# EAGLE design eeZee_big_tiny (EAGLE 6.4)
DATABASE: ./../../../EAGLE/PARTSDB.TXT
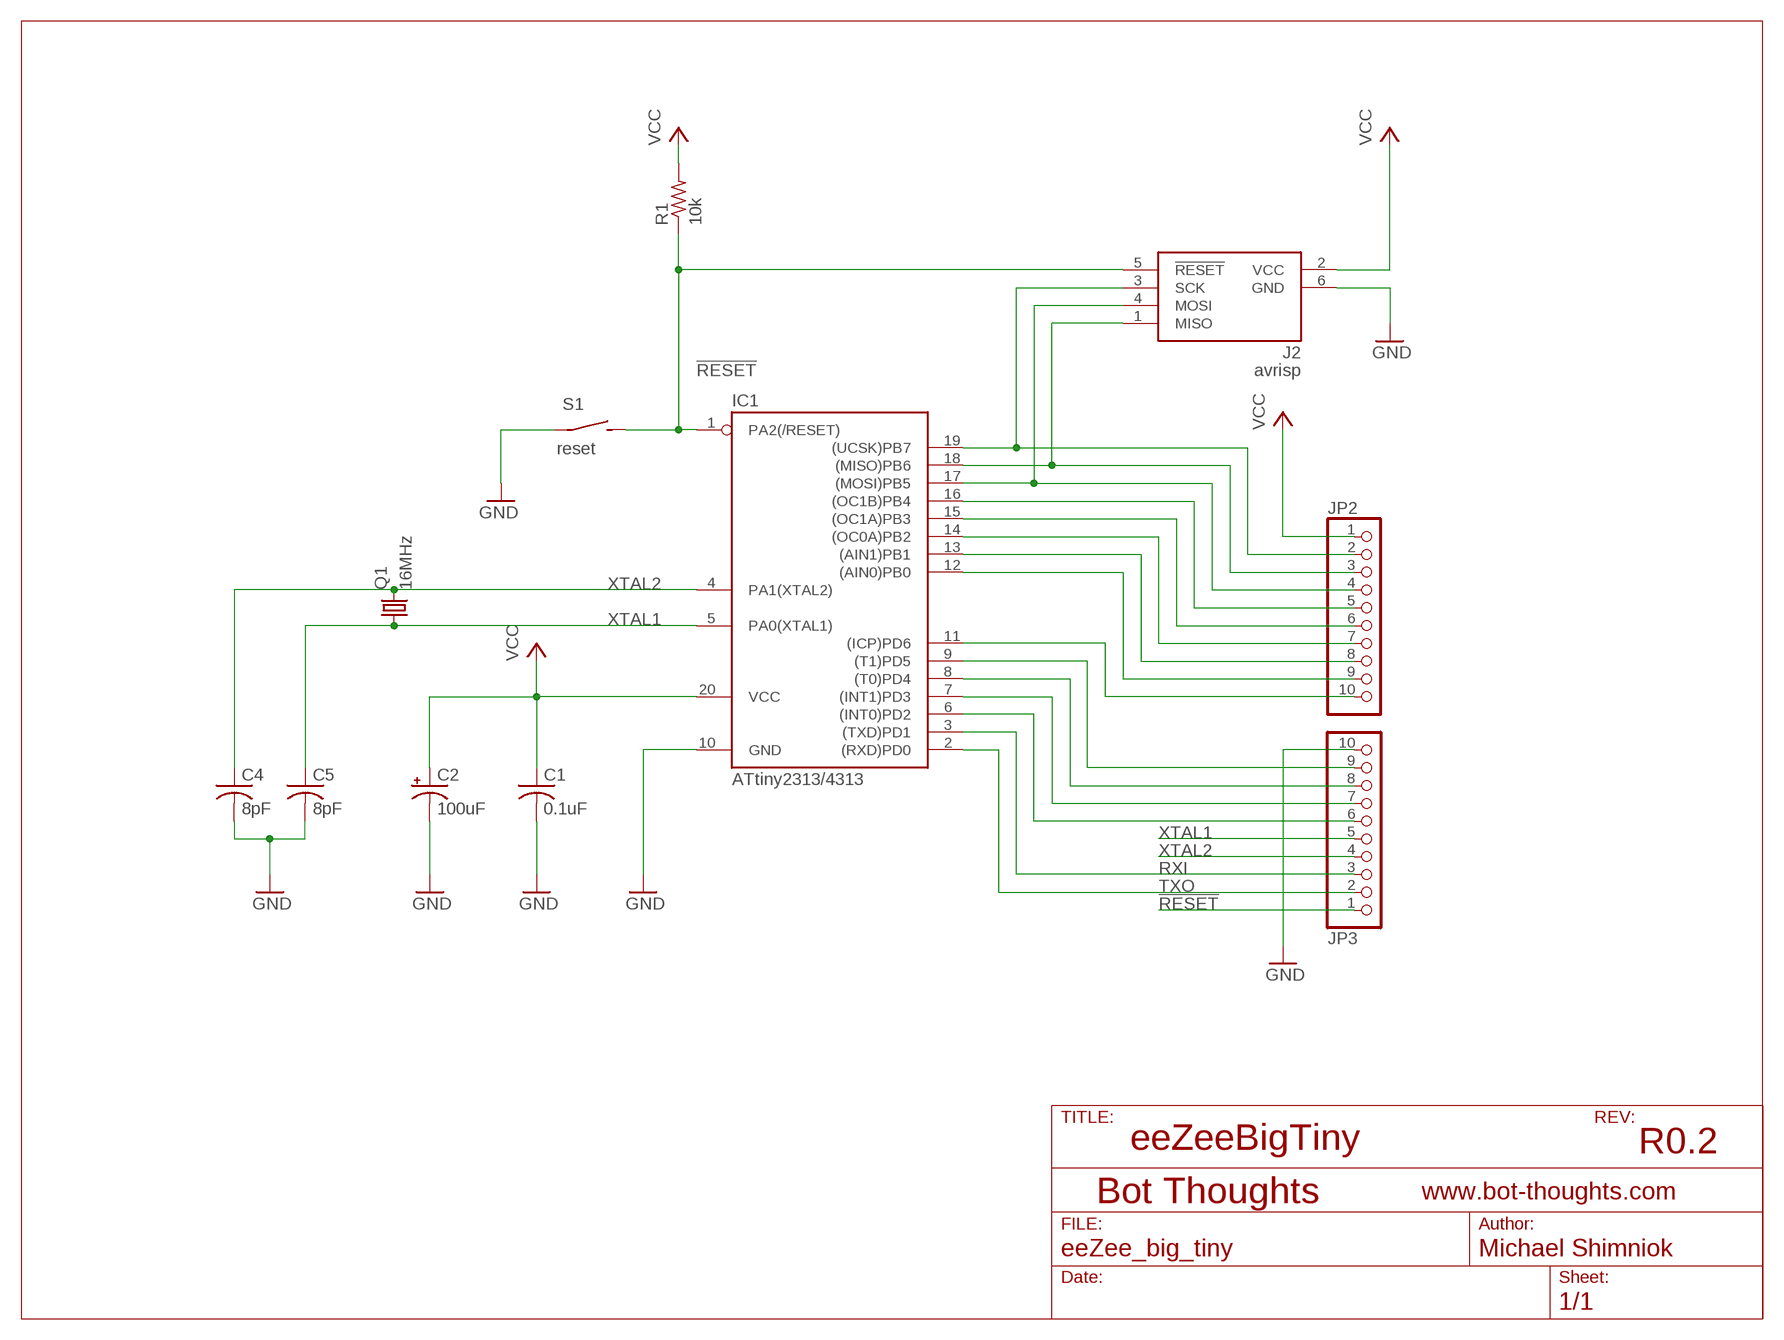
[diagram p0: schematic, sheet 1]

## Parts
C1  0.1uF  C-USC0603  [C0603]
C2  100uF  CAP_POL_SMC_B  [SMC_B]
C4  8pF  C-USC0603  [C0603]
C5  8pF  C-USC0603  [C0603]
IC1  ATtiny2313/4313  TINY2313-*P*  [DIL20]
J2  avrisp  AVRISP6  [CON6P2R]
JP2  PINHD-1X10_2.54-S  [1X10-S]
JP3  PINHD-1X10_2.54-S  [1X10-S]
Q1  16MHz  CRYSTALNDK5X3  [NDK_2PAD_5X3]
R1  10k  R-US_R0603  [R0603]
S1  reset  SPST_TAC_RECT1  [6MMTACTILE_RECT]

## Nets
!RESET: IC1.1(PA2(/RESET)) J2.5(!RESET) JP3.1 R1.1 S1.P$2(S)
GND: C1.2 C2.- C4.2 C5.2 IC1.10(GND) J2.6(GND) JP3.10 S1.P$1(P)
N$2: IC1.18((MISO)PB6) J2.1(MISO) JP2.3
N$3: IC1.17((MOSI)PB5) J2.4(MOSI) JP2.4
N$4: IC1.19((UCSK)PB7) J2.3(SCK) JP2.2
N$6: IC1.6((INT0)PD2) JP3.6
N$7: IC1.7((INT1)PD3) JP3.7
N$8: IC1.8((T0)PD4) JP3.8
N$9: IC1.9((T1)PD5) JP3.9
N$10: IC1.11((ICP)PD6) JP2.10
N$11: IC1.12((AIN0)PB0) JP2.9
N$12: IC1.13((AIN1)PB1) JP2.8
N$13: IC1.14((OC0A)PB2) JP2.7
N$14: IC1.15((OC1A)PB3) JP2.6
N$15: IC1.16((OC1B)PB4) JP2.5
RXI: IC1.3((TXD)PD1) JP3.3
TXO: IC1.2((RXD)PD0) JP3.2
VCC: C1.1 C2.+ IC1.20(VCC) J2.2(VCC) JP2.1 R1.2
XTAL1: C5.1 IC1.5(PA0(XTAL1)) JP3.5 Q1.P$1
XTAL2: C4.1 IC1.4(PA1(XTAL2)) JP3.4 Q1.P$2

## Notes on the sheet
- eeZeeBigTiny | R0.2

## Library data of the parts
C1 C4 C5 = rcl:C-US: CAPACITOR, American symbol; BOM: EXCLUDE; PARTNO: 0603YC104KAT2A
C2 = mes_rcl:CAP_POL: Capacitor, Polarized, American symbol; BOM: EXCLUDE; PARTNO: MCTT21X106M6R3CT
IC1 = avr-7:TINY2313*: Atmel Tiny2313 2K Flash, 128 bytes EEPROM, 128 bytes RAM
J2 = ads4:AVRISP6: 6-pin dual-row connector for Atmel AVRISP programmer interface
JP2 JP3 = pinhead-2:PINHD-1X10: PIN HEADER
Q1 = mes_crystal:CRYSTAL: CRYSTAL
R1 = rcl:R-US_: RESISTOR, American symbol; PARTNO: ERJ-3GEYJ103V
S1 = mes_electromech:SPST: SPST SWITCH

## Board
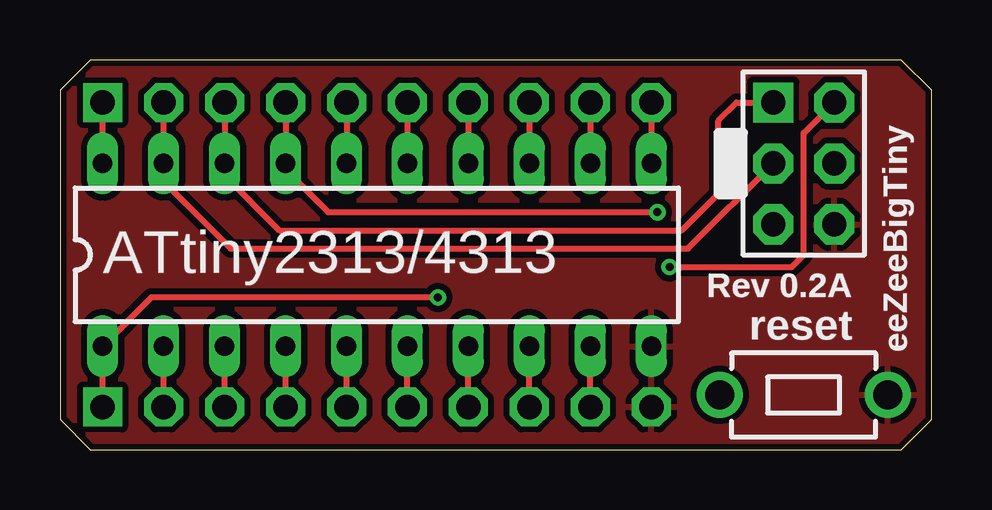
[diagram p1: board, top side]
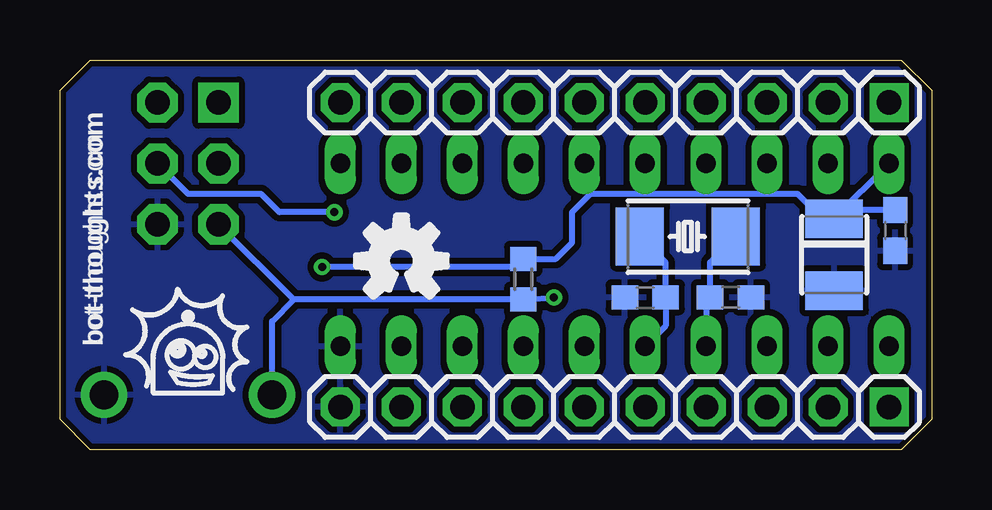
[diagram p2: board, bottom side, seen from below]

Size 36.32 x 16.26 mm. Coordinates in mm from the lower left corner, seen from the top.
Outline: 0,14.99 0,1.27 1.27,0 35.05,0 36.32,1.27 36.32,14.99 35.05,16.26 1.27,16.26 0,14.99
Copper layers (1*16): Top 0.0356mm / dielectric 1.5011mm / Bottom 0.0356mm
Design rules "LaenPCBOrder *": minimum track width 6mil, minimum drill 13mil, track to track 10mil, track to pad 10mil, pad to pad 10mil, via to via 10mil, smd to smd 8mil, copper to edge 10mil, drill to drill 10mil, minimum pad ring 7mil, minimum via ring 7mil, stop-mask expansion 3mil, vias tented up to drill 20mil, thermal gap 10mil

### Footprints (pad centres in the part's own frame; a part is rotated, then mirrored left to right if it is on the bottom)
C0603 = smd 1.1 x 1: 1 -0.85,0; 2 0.85,0
SMC_B = smd 1.6 x 2.4: + -1.5,0; - 1.5,0
DIL20 = drill 0.813 long: 1 -11.43,-3.81; 2 -8.89,-3.81; 3 -6.35,-3.81; 4 -3.81,-3.81; 5 -1.27,-3.81; 6 1.27,-3.81; 7 3.81,-3.81; 8 6.35,-3.81; 9 8.89,-3.81; 10 11.43,-3.81; 11 11.43,3.81; 12 8.89,3.81; 13 6.35,3.81; 14 3.81,3.81; 15 1.27,3.81; 16 -1.27,3.81; 17 -3.81,3.81; 18 -6.35,3.81; 19 -8.89,3.81; 20 -11.43,3.81
CON6P2R = drill 1.016 pad 1.676 square: 1 -2.54,-1.27 | drill 1.016 pad 1.676 octagon: 2 -2.54,1.27; 3 0,-1.27; 4 0,1.27; 5 2.54,-1.27; 6 2.54,1.27
1X10-S = drill 1.016 square: 1 -11.43,0 | drill 1.016 octagon: 2 -8.89,0; 3 -6.35,0; 4 -3.81,0; 5 -1.27,0; 6 1.27,0; 7 3.81,0; 8 6.35,0; 9 8.89,0; 10 11.43,0
NDK_2PAD_5X3 = smd 2 x 2.4: P$1 -2,0; P$2 2,0
R0603 = smd 1 x 1.1: 1 -0.85,0; 2 0.85,0
6MMTACTILE_RECT = drill 1.2: P$1 -3.5,0; P$2 3.5,0

### Placement (x,y rotation side)
C1  1.52,9.14 270 bottom
C2  4.06,8.13 270 bottom
C4  8.38,6.35 0 bottom
C5  11.94,6.35 180 bottom
IC1  13.21,8.13 0 top
J2  30.99,11.94 270 top
JP2  13.21,14.48 180 bottom
JP3  13.21,1.78 180 bottom
Q1  10.16,8.89 0 bottom
R1  17.02,7.11 90 bottom
S1  30.99,2.29 180 top

### Tracks (layer width: path | path; a pad name or v marks a point on that pad's centre or on a via)
!RESET  (via drill 0.33)
  Top 0.254: JP3.1 IC1.1 3.81,6.35 v15.75,6.35
  Bottom 0.254: v15.75,6.35 16.85,6.26 R1.1 26.58,6.26 | 26.58,6.26 J2.5 | S1.P$2 27.49,5.36 26.58,6.26
GND
  pour Bottom: 0,16.26 36.32,16.26 36.32,0 0,0
  pour Top: 0,16.26 36.32,16.26 36.32,0 0,0
N$2
  Top 0.254: JP2.3 IC1.18 6.86,11.43 9.14,9.14 25.91,9.14 27.43,10.67 27.43,13.72 28.19,14.48 J2.1
N$3  (via drill 0.33)
  Top 0.254: JP2.4 IC1.17 9.4,11.68 11.18,9.91 v24.89,9.91
  Bottom 0.254: v24.89,9.91 27.18,9.91 27.94,10.67 30.99,10.67 J2.4
N$4
  Top 0.254: JP2.2 IC1.19 4.32,11.18 7.11,8.38 26.16,8.38 J2.3
N$6
  Top 0.254: JP3.6 IC1.6
N$7
  Top 0.254: JP3.7 IC1.7
N$8
  Top 0.254: JP3.8 IC1.8
N$9
  Top 0.254: JP3.9 IC1.9
N$10
  Top 0.254: JP2.10 IC1.11
N$11
  Top 0.254: JP2.9 IC1.12
N$12
  Top 0.254: JP2.8 IC1.13
N$13
  Top 0.254: JP2.7 IC1.14
N$14
  Top 0.254: JP2.6 IC1.15
N$15
  Top 0.254: JP2.5 IC1.16
RXI
  Top 0.254: JP3.3 IC1.3
TXO
  Top 0.254: JP3.2 IC1.2
VCC  (via drill 0.33)
  Top 0.254: IC1.20 JP2.1 | v25.4,7.62 30.48,7.62 30.99,8.13 30.99,13.21 J2.2
  Bottom 0.254: C2.+ 4.55,9.63 5.59,10.67 14.22,10.67 14.99,9.91 14.99,8.64 15.66,7.96 R1.2 17.02,7.87 17.27,7.62 v25.4,7.62 | C2.+ 4.06,9.65 IC1.20 | C1.1 3.7,9.99 C2.+
XTAL1
  Top 0.254: JP3.5 IC1.5
  Bottom 0.254: IC1.5 11.09,5.17 C5.1 11.09,7.82 Q1.P$1
XTAL2
  Top 0.254: JP3.4 IC1.4
  Bottom 0.254: IC1.4 9.4,6.18 C4.1 9.23,7.82 Q1.P$2

### Text on the board
tNames: Rev 0.2A | eeZeeBigTiny
bNames: bot-thoughts.com
tsilk: ATtiny2313/4313 | Rev 0.2A | reset | eeZeeBigTiny
bsilk: bot-thoughts.com